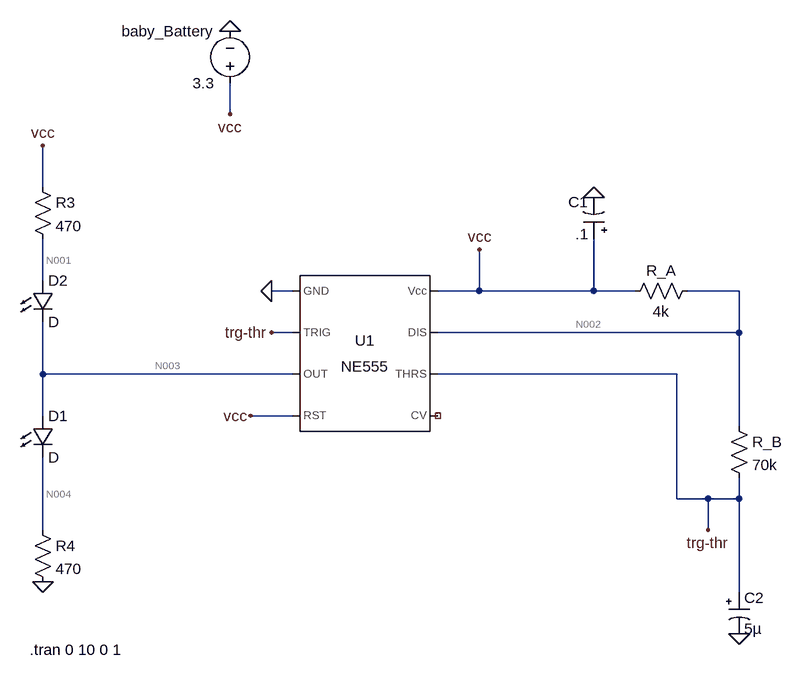
[diagram p0: schematic 555timer.asc]
555timer.asc, the LTspice schematic file:
Version 4
SHEET 1 920 680
WIRE 16 -176 16 -224
WIRE -272 -64 -272 -128
WIRE -272 80 -272 16
WIRE 112 96 80 96
WIRE 400 96 400 32
WIRE 400 96 336 96
WIRE 576 96 576 16
WIRE 576 96 400 96
WIRE 640 96 576 96
WIRE 800 96 720 96
WIRE 112 160 80 160
WIRE 800 160 800 96
WIRE 800 160 336 160
WIRE -272 224 -272 144
WIRE 112 224 -272 224
WIRE 704 224 336 224
WIRE -272 288 -272 224
WIRE 112 288 48 288
WIRE 800 304 800 160
WIRE 704 416 704 224
WIRE 752 416 704 416
WIRE 800 416 800 384
WIRE 800 416 752 416
WIRE -272 464 -272 352
WIRE 752 464 752 416
WIRE 800 560 800 416
FLAG 80 160 trg-thr
FLAG 576 -48 0
FLAG 80 96 0
FLAG 752 464 trg-thr
FLAG 800 624 0
FLAG -272 544 0
FLAG 48 288 vcc
FLAG 400 32 vcc
FLAG -272 -128 vcc
FLAG 16 -304 0
FLAG 16 -176 vcc
SYMBOL Misc\\NE555 224 192 R0
SYMATTR InstName U1
SYMBOL polcap 592 16 R180
WINDOW 0 24 57 Left 2
WINDOW 3 24 8 Left 2
SYMATTR InstName C1
SYMATTR Value .1
SYMBOL res 736 80 R90
WINDOW 0 0 56 VBottom 2
WINDOW 3 32 56 VTop 2
SYMATTR InstName R_A
SYMATTR Value 4k
SYMBOL res 784 288 R0
SYMATTR InstName R_B
SYMATTR Value 70k
SYMBOL polcap 784 560 R0
SYMATTR InstName C2
SYMATTR Value 5µ
SYMBOL LED -288 288 R0
SYMATTR InstName D1
SYMBOL res -288 -80 R0
SYMATTR InstName R3
SYMATTR Value 470
SYMBOL res -288 448 R0
SYMATTR InstName R4
SYMATTR Value 470
SYMBOL LED -288 80 R0
SYMATTR InstName D2
SYMBOL voltage 16 -208 R180
WINDOW 0 24 96 Left 2
WINDOW 3 24 16 Left 2
SYMATTR InstName baby_Battery
SYMATTR Value 3.3
TEXT -292 648 Left 2 !.tran 0 10 0 1

The netlist it stands for:
* 555timer.asc
XU1 0 trg-thr N003 vcc NC_01 trg-thr N002 vcc NE555  ; pins GND TRIG OUT RST CV THRS DIS Vcc
C1 vcc 0 .1
R_A N002 vcc 4k
R_B N002 trg-thr 70k
C2 trg-thr 0 5µ
D1 N003 N004 D
R3 vcc N001 470
R4 N004 0 470
D2 N001 N003 D
V§baby_Battery vcc 0 3.3
.model D D
.lib standard.dio
.tran 0 10 0 1
.lib NE555.sub
.backanno
.end

* Results of the author's LTspice run, read from the files saved beside the schematic
* Operating Point, zero values left out:
*   V(trg-thr) = 3.299 V
*   V(vcc) = 3.3 V
*   V(n002) = 3.3 V
*   V(n003) = 3.267 V
*   V(n004) = 2.568 V
*   V(n001) = 3.3 V
*   I(D1) = 5.464 mA
*   I(R4) = 5.464 mA
*   I(R_b) = 6.599 nA
*   I(R_a) = -11 nA
*   I(Baby_battery) = -6.524 mA
*   Ix(u1:1) = -1.06 mA
*   Ix(u1:2) = 3.299 nA
*   Ix(u1:3) = -5.464 mA
*   Ix(u1:4) = 11.33 µA
*   Ix(u1:6) = 3.299 nA
*   Ix(u1:7) = 4.403 nA
*   Ix(u1:8) = 6.512 mA
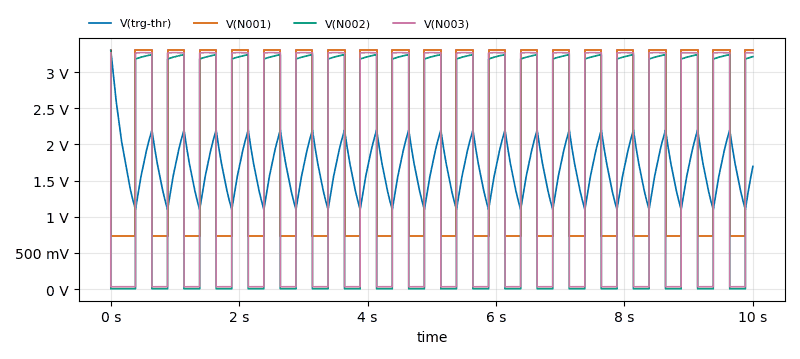
[diagram p1: Transient Analysis of 555timer.asc, plotted from the saved traces]
* Transient Analysis, 1 run:
*   V(trg-thr): min 1.099 V, max 3.299 V, average 1.662 V, rms 1.703 V, last 1.697 V
*   V(N001): min 731.8 mV, max 3.3 V, average 2.014 V, rms 2.388 V, last 3.3 V
*   V(N002): min 5.036 mV, max 3.3 V, average 1.607 V, rms 2.27 V, last 3.213 V
*   V(N003): min 32.8 mV, max 3.269 V, average 1.647 V, rms 2.308 V, last 3.267 V